# EAGLE design RemoteControl-v1 (EAGLE 6.3)
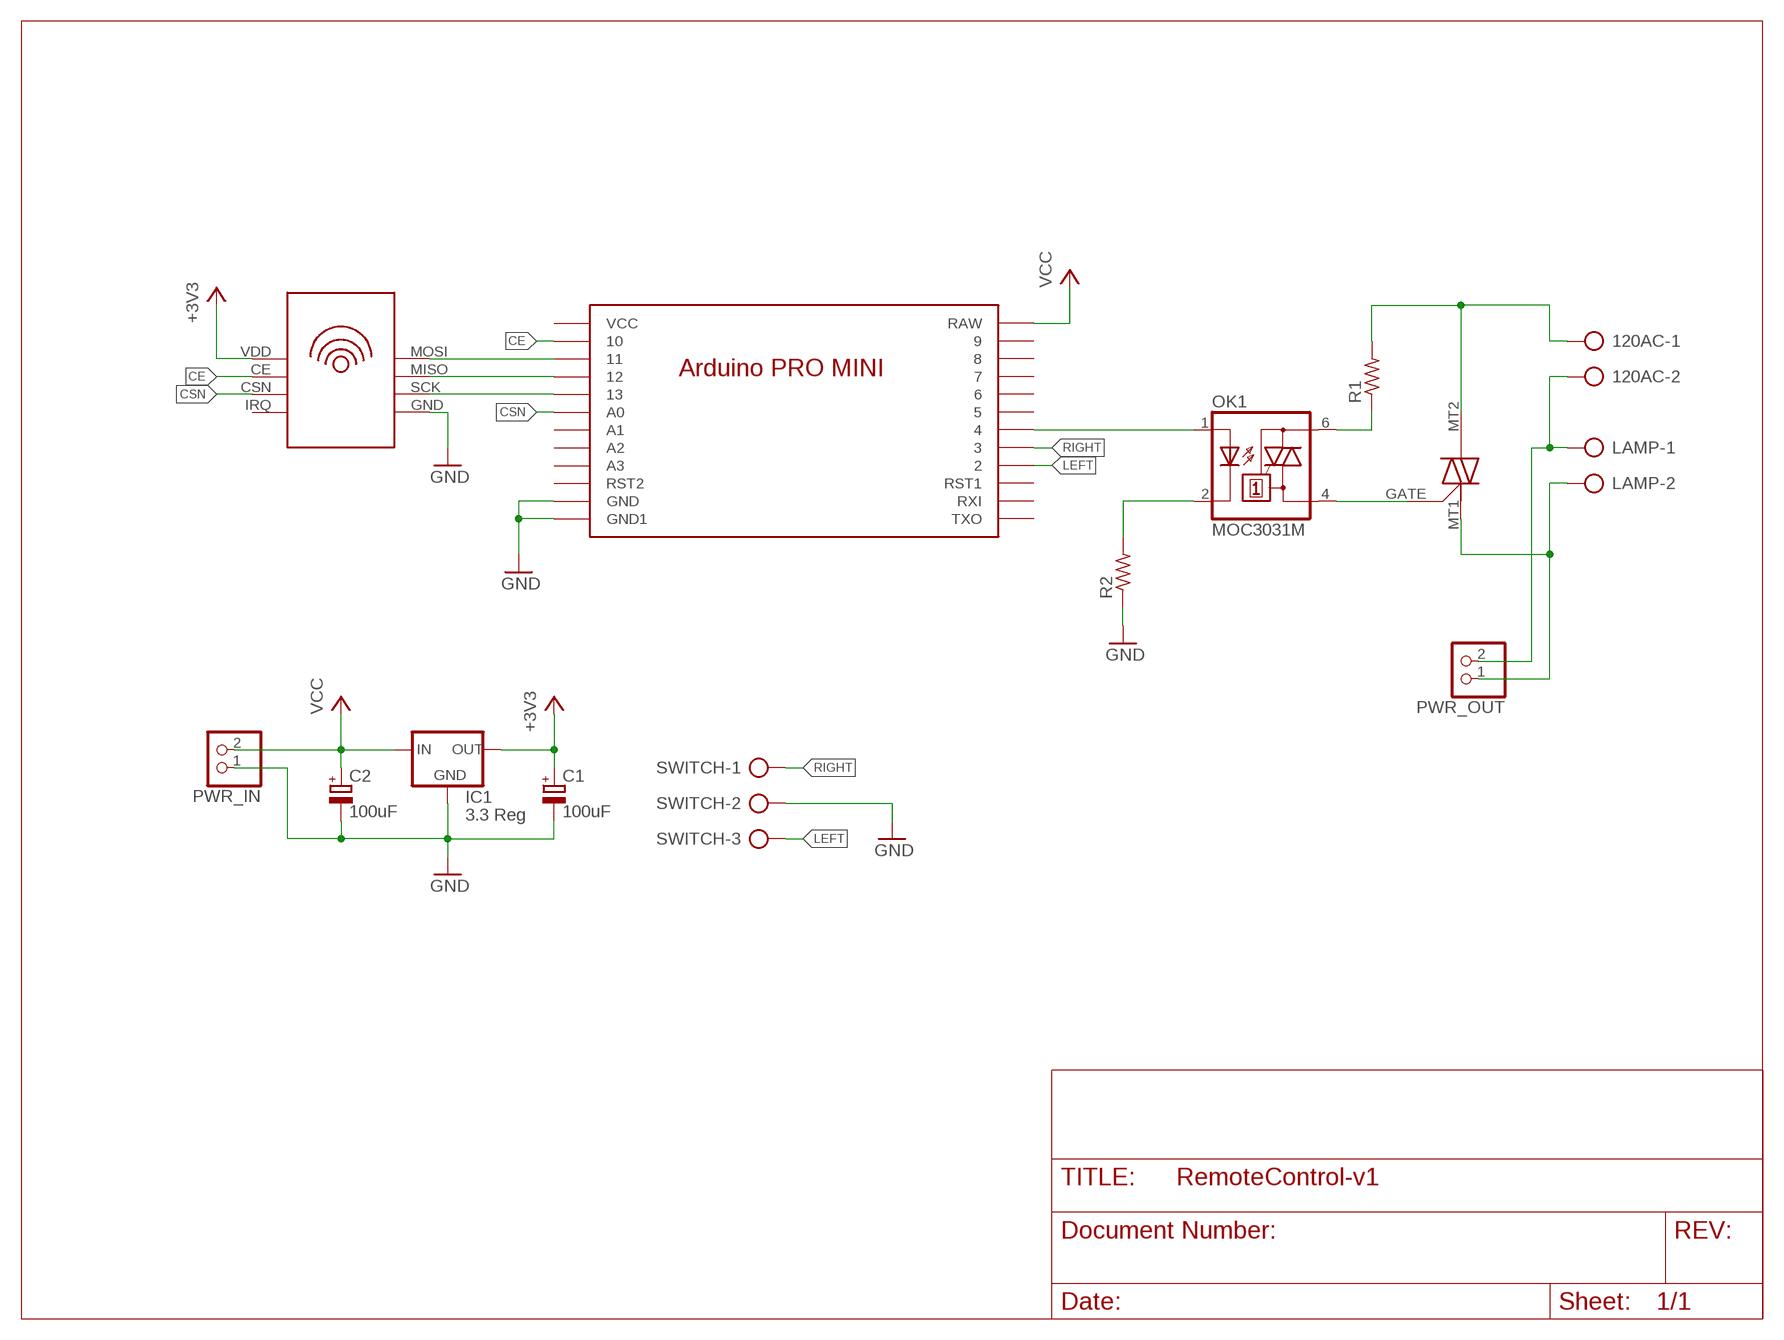
[diagram p0: schematic, sheet 1]

## Parts
120AC  AK300/2  [AK300/2]
C1  100uF  CPOL-EUE2.5-5  [E2,5-5]
C2  100uF  CPOL-EUE2.5-5  [E2,5-5]
IC1  3.3 Reg  78LXX  [78LXX]
LAMP  AK300/2  [AK300/2]
NRF24L01  NRF24L01  [NRF24L01]
OK1  MOC3031M  [DIL06]
PWR_IN  PINHD-1X2  [1X02]
PWR_OUT  PINHD-1X2  [1X02]
R1  R-US_0204/7  [0204/7]
R2  R-US_0204/7  [0204/7]
SWITCH  AK300/3  [AK300/3]
U$1  NANO  [NANO]
U$2  MAC12  [MAC12]

## Nets
+3V3: C1.+ IC1.OUT NRF24L01.VDD
CE: NRF24L01.CE U$1.10
CSN: NRF24L01.CSN U$1.A0
GND: C1.- C2.- IC1.GND NRF24L01.GND PWR_IN.1 R2.1 SWITCH.2 U$1.GND1(GND) U$1.GND2(GND1)
LEFT: SWITCH.3 U$1.2
N$1: NRF24L01.SCK U$1.13
N$2: NRF24L01.MISO U$1.12
N$3: NRF24L01.MOSI U$1.11
N$4: OK1.6(A2) R1.1
N$5: LAMP.2 PWR_OUT.1 U$2.MT1
N$6: 120AC.2 LAMP.1 PWR_OUT.2
N$7: 120AC.1 R1.2 U$2.MT2
N$8: OK1.2(C) R2.2
N$10: OK1.4(A1) U$2.GATE
N$11: OK1.1(A) U$1.4
RIGHT: SWITCH.1 U$1.3
VCC: C2.+ IC1.IN PWR_IN.2 U$1.RAW
Unconnected: NRF24L01.IRQ U$1.5 U$1.6 U$1.7 U$1.8 U$1.9 U$1.A1 U$1.A2 U$1.A3 U$1.RST1 U$1.RST2 U$1.RXI U$1.TXO U$1.VCC

## Library data of the parts
120AC LAMP = con-ptr500:AK300/2: CONNECTOR; OC_FARNELL: unknown; OC_NEWARK: unknown
C1 C2 = resistor:CPOL-EU: POLARIZED CAPACITOR, European symbol
IC1 = v-reg:78LXX: VOLTAGE REGULATOR
NRF24L01 = E-Lab:NRF24L01
OK1 = optocoupler:MOC30*: 6-Pin DIP Zero-Cross Optoisolators Triac Driver Output (250/400 Volt Peak) Source: http://www.fairchildsemi.com/ds/MO/MOC3043-M.pdf; MF: FAIRCHILD SEMICONDUCTOR; MPN: MOC3031M; OC_FARNELL: 9875964; OC_NEWARK: 78K6089
PWR_IN PWR_OUT = pinhead:PINHD-1X2: PIN HEADER
R1 R2 = resistor:R-US_: RESISTOR, American symbol
SWITCH = con-ptr500:AK300/3: CONNECTOR; OC_FARNELL: unknown; OC_NEWARK: unknown
U$1 = E-Lab:NANO
U$2 = E-Lab:MAC12

## Board
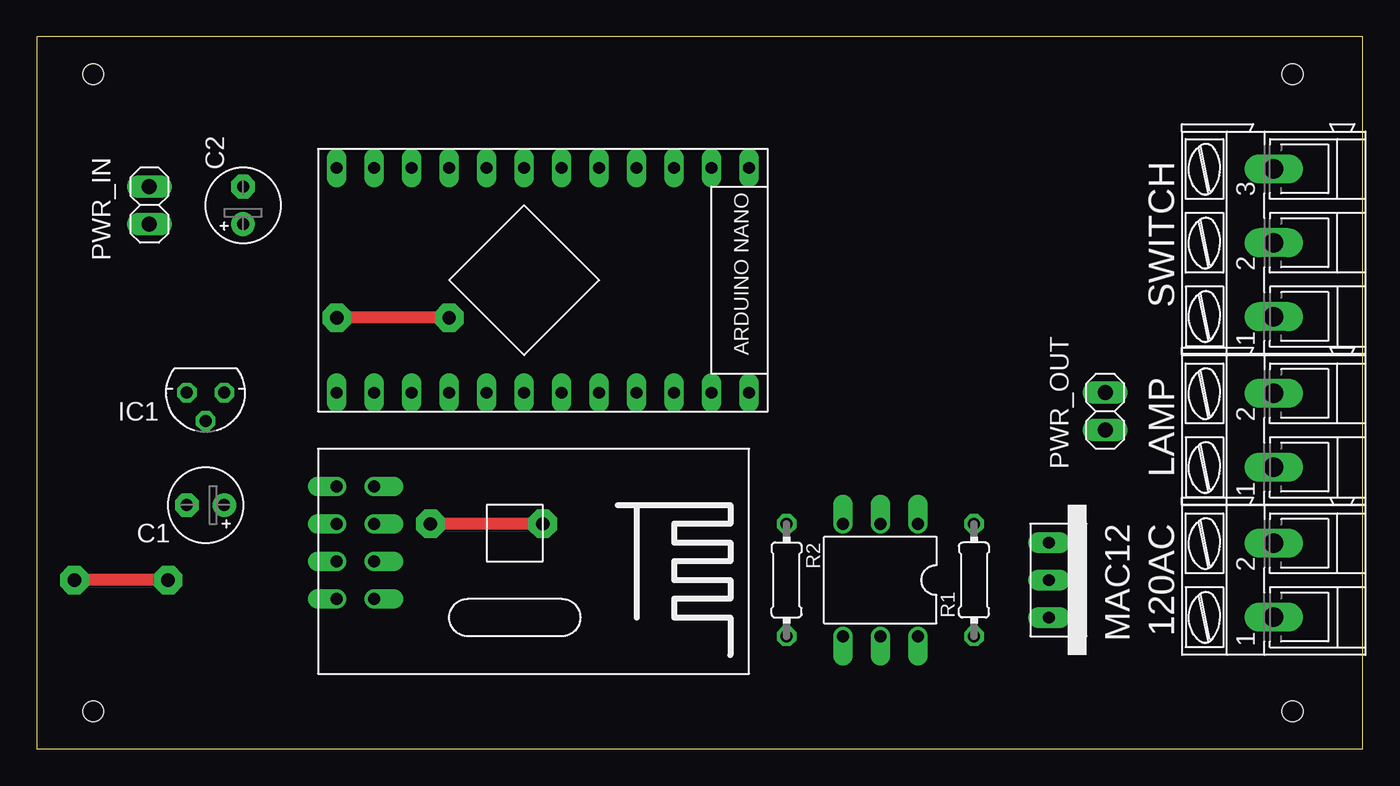
[diagram p1: board, top side]
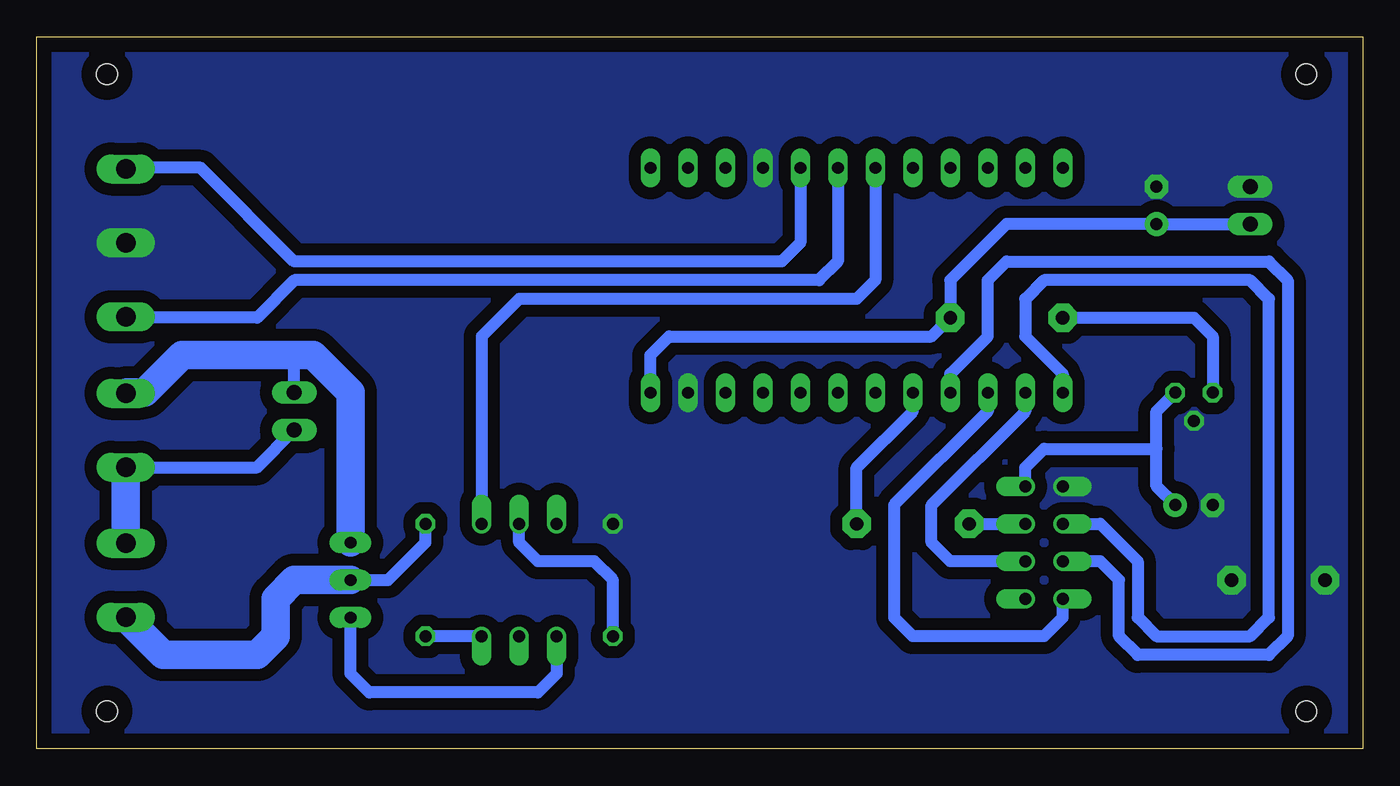
[diagram p2: board, bottom side, seen from below]

Size 89.84 x 48.25 mm. Coordinates in mm from the lower left corner, seen from the top.
Outline: 0,0 89.84,0 89.84,48.25 0,48.25 0,0
Copper layers (1*16): Top 0.035mm / dielectric 1.5mm / Bottom 0.035mm
Design rules "default": minimum track width 10mil, minimum drill 24mil, track to track 8mil, track to pad 8mil, pad to pad 8mil, via to via 8mil, smd to smd 8mil, copper to edge 40mil, drill to drill 8mil, minimum pad ring 10mil, minimum via ring 8mil, stop-mask expansion 4mil, vias tented up to drill 0mil, thermal gap 10mil
Holes 1.4 mm at 3.81,2.54 3.81,45.72 85.09,45.72 85.09,2.54

### Footprints (pad centres in the part's own frame; a part is rotated, then mirrored left to right if it is on the bottom)
AK300/2 = drill 1.321 long: 1 -2.515,0; 2 2.489,0
E2,5-5 = drill 0.813 pad 1.6: + -1.27,0 | drill 0.813 pad 1.6 octagon: - 1.27,0
78LXX = drill 0.813 octagon: GND 0,1.905; IN 1.27,0; OUT -1.27,0
NRF24L01 = drill 0.8 offset: CE 1.27,-2.54; CSN -1.27,-2.54; GND 1.27,-5.08; IRQ -1.27,2.54; MISO 1.27,2.54; MOSI -1.27,0; SCK 1.27,0; VDD -1.27,-5.08
DIL06 = drill 0.813 offset: 1 -2.54,-3.81; 2 0,-3.81; 3 2.54,-3.81; 4 2.54,3.81; 5 0,3.81; 6 -2.54,3.81
1X02 = drill 1.016 long: 1 -1.27,0; 2 1.27,0
0204/7 = drill 0.813 octagon: 1 -3.81,0; 2 3.81,0
AK300/3 = drill 1.321 long: 1 -5.004,0; 2 0,0; 3 5.004,0
NANO = drill 0.8 long: 2 7.62,-5.08; 3 7.62,-2.54; 4 7.62,0; 5 7.62,2.54; 6 7.62,5.08; 7 7.62,7.62; 8 7.62,10.16; 9 7.62,12.7; 10 -7.62,12.7; 11 -7.62,10.16; 12 -7.62,7.62; 13 -7.62,5.08; A0 -7.62,2.54; A1 -7.62,0; A2 -7.62,-2.54; A3 -7.62,-5.08; GND1 -7.62,-12.7; GND2 7.62,-7.62; RAW -7.62,-15.24; RST1 -7.62,-10.16; RST2 7.62,-10.16; RXI 7.62,-12.7; TXO 7.62,-15.24; VCC -7.62,-7.62
MAC12 = drill 0.8 pad 1.422 long: GATE 2.54,0; MT1 -2.54,0; MT2 0,0

### Placement (x,y rotation side)
120AC  83.82,11.43 90 top
C1  11.43,16.51 180 top
C2  13.97,36.83 90 top
IC1  11.43,24.13 180 top
LAMP  83.82,21.59 90 top
NRF24L01  21.59,12.7 180 top
OK1  57.15,11.43 180 top
PWR_IN  7.62,36.83 270 top
PWR_OUT  72.39,22.86 270 top
R1  63.5,11.43 90 top
R2  50.8,11.43 270 top
SWITCH  83.82,34.29 90 top
U$1  33.02,31.75 90 top
U$2  68.58,11.43 270 top

### Tracks (layer width: path | path; a pad name or v marks a point on that pad's centre or on a via)
+3V3
  Bottom 0.813: C1.+ 13.97,17.78 13.97,20.32 | 13.97,20.32 13.97,22.86 IC1.OUT | NRF24L01.VDD 22.86,19.05 21.59,20.32 13.97,20.32
CE
  Bottom 0.813: NRF24L01.CE 17.78,15.24 15.24,12.7 15.24,8.89 13.97,7.62 7.62,7.62 6.35,8.89 6.35,30.48 7.62,31.75 21.59,31.75 22.86,30.48 22.86,27.94 20.32,25.4 U$1.10
CSN  (via drill 0.9 pad 1.93)
  Top 0.813: v34.29,15.24 v26.67,15.24
  Bottom 0.813: v26.67,15.24 NRF24L01.CSN | v34.29,15.24 34.29,19.05 30.48,22.86 U$1.A0
GND  (via drill 0.9 pad 1.93)
  Top 0.813: v8.89,11.43 v2.54,11.43
  pour Bottom (isolate 0.813, no thermals): 0,0 0,48.26 90.17,48.26 90.17,0
LEFT
  Bottom 0.813: U$1.2 38.1,34.29 39.37,33.02 72.39,33.02 78.74,39.37 83.74,39.37 SWITCH.3
N$1
  Bottom 0.813: NRF24L01.SCK 17.78,12.7 16.51,11.43 16.51,7.62 15.24,6.35 6.35,6.35 5.08,7.62 5.08,31.75 6.35,33.02 24.13,33.02 25.4,31.75 25.4,27.94 27.94,25.4 U$1.13
N$2
  Bottom 0.813: U$1.12 25.4,22.86 31.75,16.51 31.75,8.89 30.48,7.62 21.59,7.62 20.32,8.89 NRF24L01.MISO
N$3
  Bottom 0.813: U$1.11 22.86,22.86 29.21,16.51 29.21,13.97 27.94,12.7 NRF24L01.MOSI
N$4
  Bottom 0.813: OK1.6 R1.1
N$5
  Bottom 0.813: PWR_OUT.1 72.39,26.67
  Bottom 1.422: 83.77,24.13 LAMP.2
  Bottom 1.93: 83.77,24.13 82.55,24.13 80.01,26.67 72.39,26.67 71.12,26.67 68.58,24.13 U$2.MT1
N$6
  Bottom 0.813: LAMP.1 74.91,19.07 PWR_OUT.2
  Bottom 1.93: 120AC.2 LAMP.1
N$7
  Bottom 0.813: U$2.MT2 66.04,11.43 63.5,13.97 R1.2
  Bottom 1.93: U$2.MT2 72.39,11.43 73.66,10.16 73.66,7.62 74.93,6.35 81.28,6.35 81.28,6.38 120AC.1
N$8
  Bottom 0.813: R2.2 50.8,11.43 52.07,12.7 55.88,12.7 57.15,13.97 OK1.2
N$10
  Bottom 0.813: OK1.4 54.61,5.08 55.88,3.81 67.31,3.81 68.58,5.08 U$2.GATE
N$11
  Bottom 0.813: U$1.4 33.02,31.75 34.29,30.48 57.15,30.48 59.69,27.94 OK1.1
RIGHT
  Bottom 0.813: U$1.3 35.56,33.02 36.83,31.75 72.39,31.75 74.93,29.21 83.74,29.21 SWITCH.1
VCC  (via drill 0.9 pad 1.93)
  Top 0.813: v27.94,29.21 v20.32,29.21
  Bottom 0.813: v20.32,29.21 11.43,29.21 10.16,27.94 IC1.IN | PWR_IN.2 C2.+ 24.13,35.56 27.94,31.75 v27.94,29.21 29.21,27.94 46.99,27.94 48.26,26.67 U$1.RAW